# EAGLE design distribution-puissance (EAGLE 9.3.0)
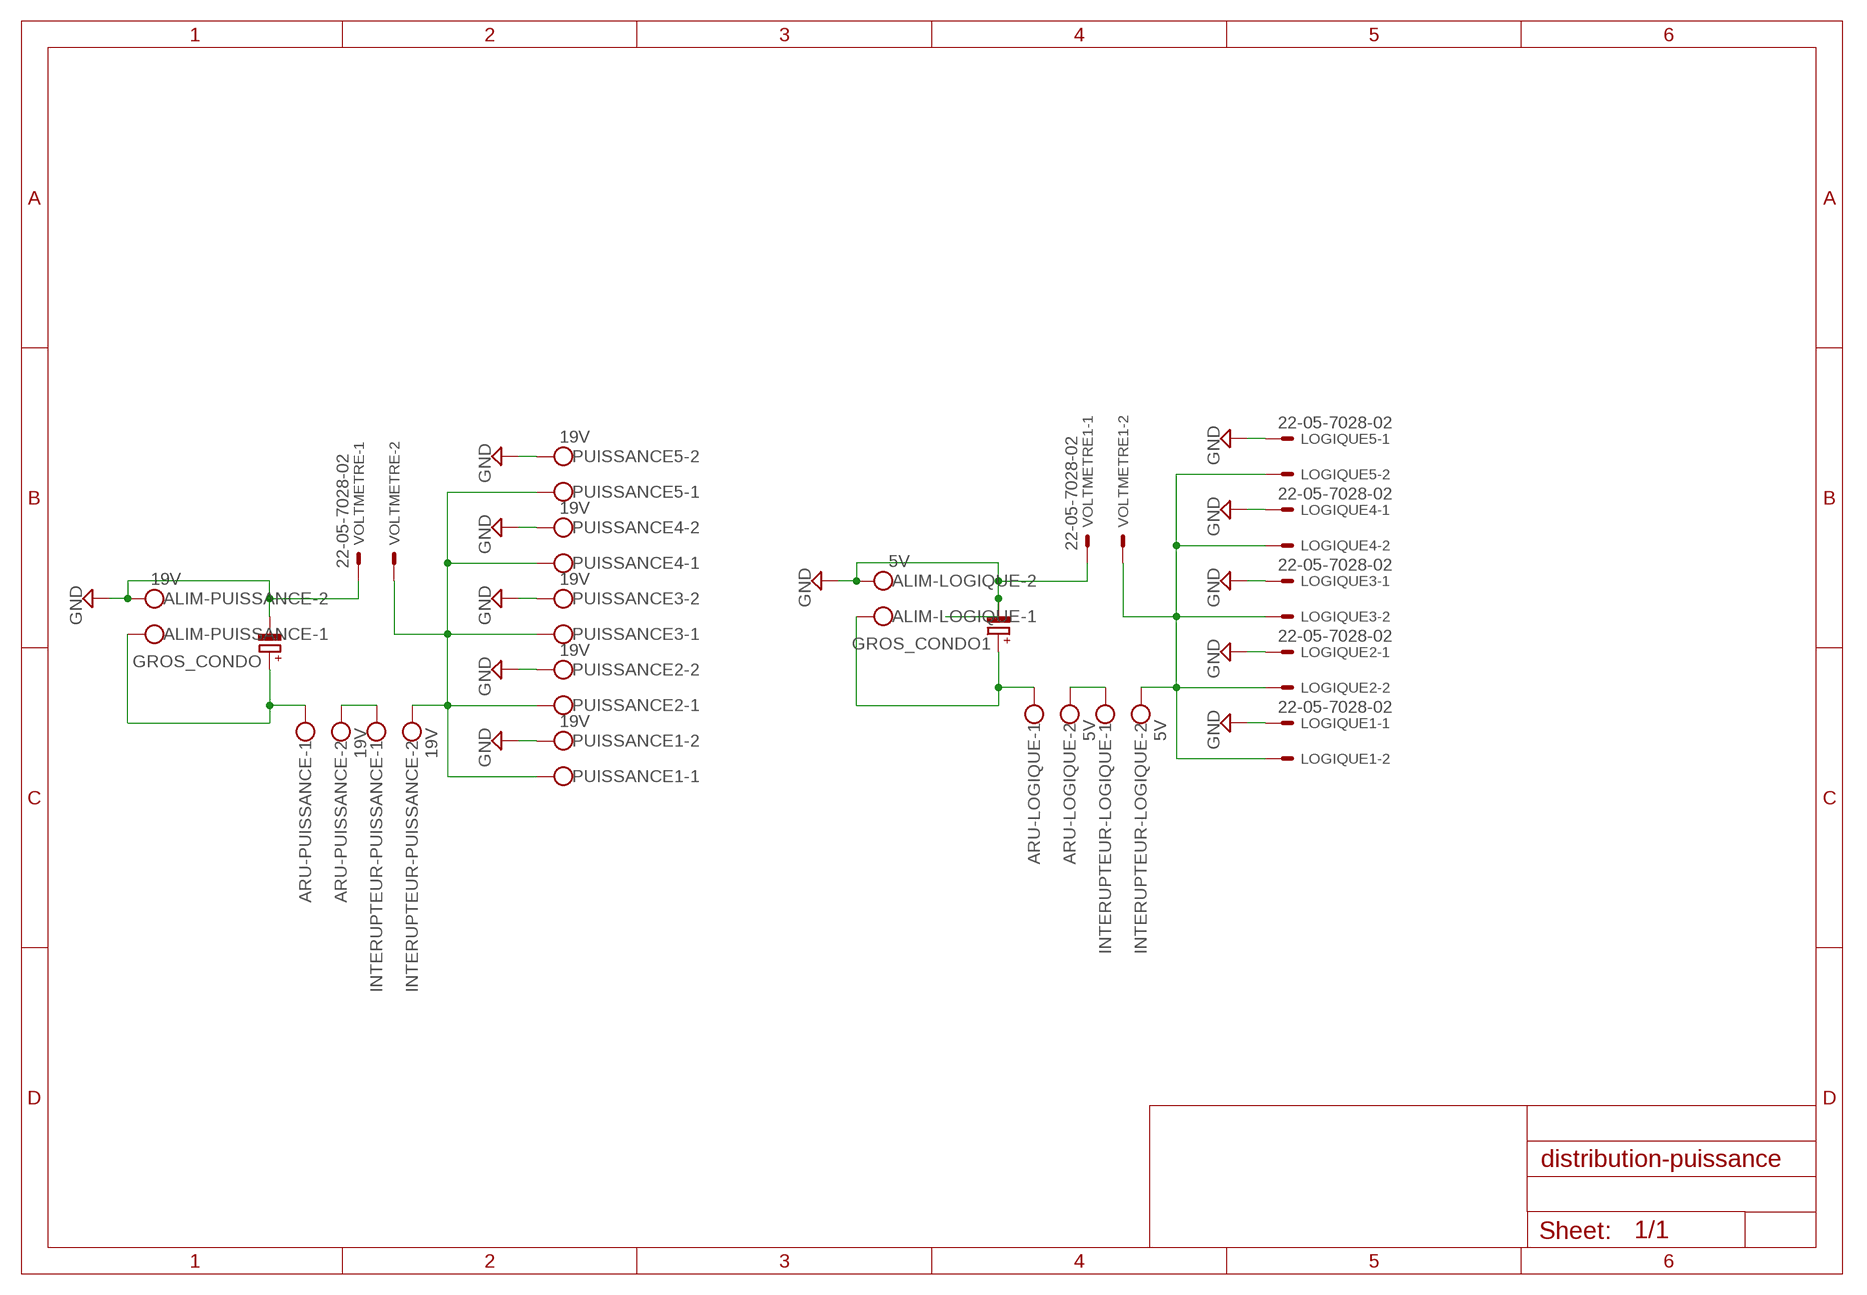
[diagram p0: schematic, sheet 1]

## Parts
ALIM-LOGIQUE  5V  W237-102  [W237-102]
ALIM-PUISSANCE  19V  W237-102  [W237-102]
ARU-LOGIQUE  5V  W237-102  [W237-102]
ARU-PUISSANCE  19V  W237-102  [W237-102]
GROS_CONDO  CPOL-EUE10-22.5  [EB22,5D]
GROS_CONDO1  CPOL-EUE10-22.5  [EB22,5D]
INTERUPTEUR-LOGIQUE  5V  W237-102  [W237-102]
INTERUPTEUR-PUISSANCE  19V  W237-102  [W237-102]
LOGIQUE1  22-05-7028-02  [7395-02]
LOGIQUE2  22-05-7028-02  [7395-02]
LOGIQUE3  22-05-7028-02  [7395-02]
LOGIQUE4  22-05-7028-02  [7395-02]
LOGIQUE5  22-05-7028-02  [7395-02]
PUISSANCE1  19V  W237-102  [W237-102]
PUISSANCE2  19V  W237-102  [W237-102]
PUISSANCE3  19V  W237-102  [W237-102]
PUISSANCE4  19V  W237-102  [W237-102]
PUISSANCE5  19V  W237-102  [W237-102]
VOLTMETRE  22-05-7028-02  [7395-02]
VOLTMETRE1  22-05-7028-02  [7395-02]

## Nets
GND: ALIM-LOGIQUE.2 ALIM-PUISSANCE.2 GROS_CONDO1.- GROS_CONDO.- LOGIQUE1.1 LOGIQUE2.1 LOGIQUE3.1 LOGIQUE4.1 LOGIQUE5.1 PUISSANCE1.2 PUISSANCE2.2 PUISSANCE3.2 PUISSANCE4.2 PUISSANCE5.2 VOLTMETRE1.1 VOLTMETRE.1
N$1: INTERUPTEUR-PUISSANCE.2 PUISSANCE1.1 PUISSANCE2.1 PUISSANCE3.1 PUISSANCE4.1 PUISSANCE5.1 VOLTMETRE.2
N$2: INTERUPTEUR-LOGIQUE.2 LOGIQUE1.2 LOGIQUE2.2 LOGIQUE3.2 LOGIQUE4.2 LOGIQUE5.2 VOLTMETRE1.2
N$3: ALIM-PUISSANCE.1 ARU-PUISSANCE.1 GROS_CONDO.+
N$4: ALIM-LOGIQUE.1 ARU-LOGIQUE.1 GROS_CONDO1.+
N$5: ARU-PUISSANCE.2 INTERUPTEUR-PUISSANCE.1
N$6: ARU-LOGIQUE.2 INTERUPTEUR-LOGIQUE.1

## Library data of the parts
ALIM-LOGIQUE ALIM-PUISSANCE ARU-LOGIQUE ARU-PUISSANCE INTERUPTEUR-LOGIQUE INTERUPTEUR-PUISSANCE PUISSANCE1-PUISSANCE5 = con-wago-500:W237-102: WAGO SCREW CLAMP; MPN: 237-102; OC_FARNELL: unknown; OC_NEWARK: 70K9898
GROS_CONDO GROS_CONDO1 = rcl:CPOL-EU: POLARIZED CAPACITOR, European symbol
LOGIQUE1-LOGIQUE5 VOLTMETRE VOLTMETRE1 = con-molex:22-?-02: CONNECTOR wire to board 2.54 mm (.1 inch) pitch header; OC_FARNELL: 9731601; OC_NEWARK: unknown

## Board
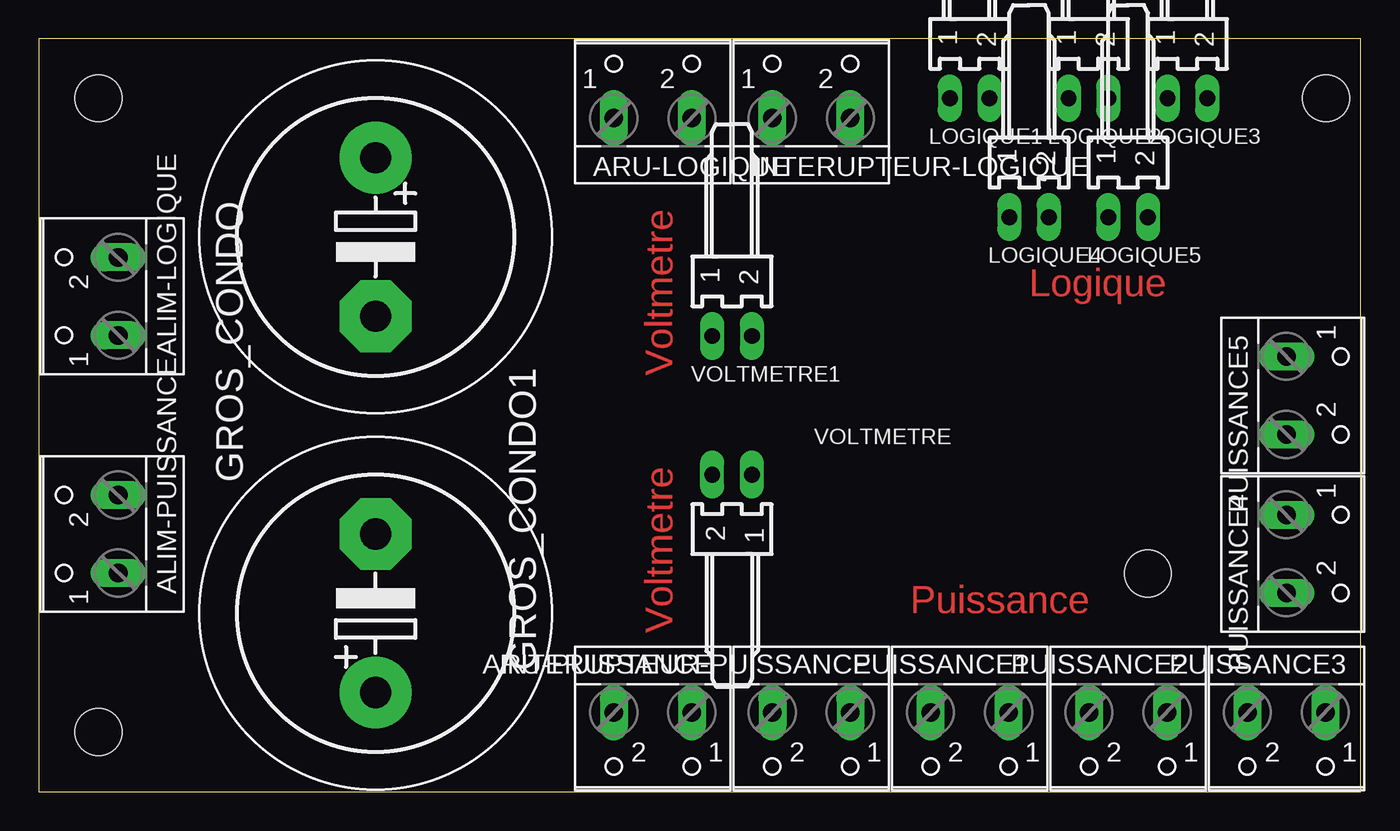
[diagram p1: board, top side]
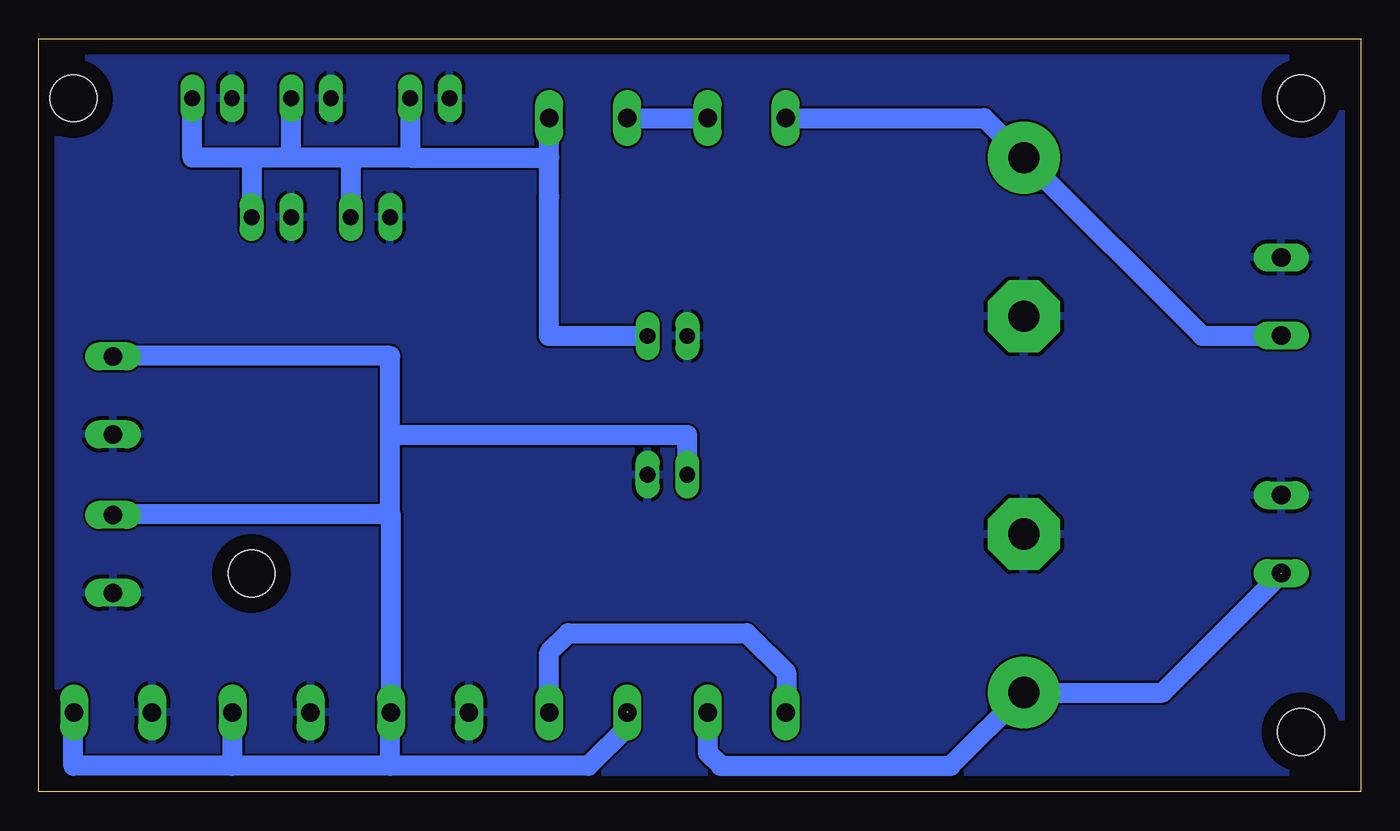
[diagram p2: board, bottom side, seen from below]

Size 84.76 x 48.25 mm. Coordinates in mm from the lower left corner, seen from the top.
Outline: 0,0 84.76,0 84.76,48.25 0,48.25 0,0
Copper layers (1*16): Top 0.035mm / dielectric 1.5mm / Bottom 0.035mm
Design rules "default": minimum track width 6mil, minimum drill 0.35mm, track to track 6mil, track to pad 6mil, pad to pad 6mil, via to via 6mil, smd to smd 6mil, copper to edge 40mil, drill to drill 6mil, minimum pad ring 10mil, minimum via ring 8mil, stop-mask expansion 4mil, vias tented up to drill 0mil, thermal gap 10mil
Holes 3 mm at 71.12,13.97 82.55,44.45 3.81,44.45 3.81,3.81

### Footprints (pad centres in the part's own frame; a part is rotated, then mirrored left to right if it is on the bottom)
W237-102 = drill 1.194 long: 1 -2.5,-1.27; 2 2.5,-1.27
EB22,5D = drill 2.007 pad 4.597: + -5.08,0 | drill 2.007 pad 4.597 octagon: - 5.08,0
7395-02 = drill 1.016 long: 1 1.27,0; 2 -1.27,0

### Placement (x,y rotation side)
ALIM-LOGIQUE  3.81,31.75 90 top
ALIM-PUISSANCE  3.81,16.51 90 top
ARU-LOGIQUE  39.37,44.45 0 top
ARU-PUISSANCE  39.37,3.81 180 top
GROS_CONDO  21.59,11.43 90 top
GROS_CONDO1  21.59,35.56 270 top
INTERUPTEUR-LOGIQUE  49.53,44.45 0 top
INTERUPTEUR-PUISSANCE  49.53,3.81 180 top
LOGIQUE1  59.69,44.45 180 top
LOGIQUE2  67.31,44.45 180 top
LOGIQUE3  73.66,44.45 180 top
LOGIQUE4  63.5,36.83 180 top
LOGIQUE5  69.85,36.83 180 top
PUISSANCE1  59.69,3.81 180 top
PUISSANCE2  69.85,3.81 180 top
PUISSANCE3  80.01,3.81 180 top
PUISSANCE4  81.28,15.24 270 top
PUISSANCE5  81.28,25.4 270 top
VOLTMETRE  44.45,20.32 0 top
VOLTMETRE1  44.45,29.21 180 top

### Tracks (layer width: path | path; a pad name or v marks a point on that pad's centre or on a via)
GND
  pour Bottom: 0,48.26 0,0 85.09,0 85.09,48.26
N$1  (1 unrouted)
  Bottom 1.27: PUISSANCE4.1 79.97,17.78 62.23,17.78 | PUISSANCE5.1 79.97,27.94 62.23,27.94 62.23,22.86 | 46.99,5.08 46.99,4.19 49.53,1.65 62.23,1.65 | 62.23,1.65 62.23,5.04 PUISSANCE1.1 62.19,17.74 62.23,17.78 | 62.23,1.65 72.39,1.65 | PUISSANCE2.1 72.35,1.69 72.39,1.65 | 72.39,1.65 82.55,1.65 82.55,5.04 PUISSANCE3.1 | 62.23,17.78 62.23,22.86 | VOLTMETRE.2 43.18,22.86 62.23,22.86
N$2
  Bottom 1.27: 52.03,40.64 52.03,38.14 52.07,38.1 52.07,29.21 VOLTMETRE1.2 | 52.03,40.64 INTERUPTEUR-LOGIQUE.2 | LOGIQUE1.2 60.96,40.64 | 60.96,40.64 52.03,40.64 | 60.96,40.64 64.77,40.64 | 64.77,40.64 LOGIQUE4.2 | 64.77,40.64 68.58,40.64 | 68.58,40.64 LOGIQUE2.2 | 68.58,40.64 71.12,40.64 | 71.12,40.64 LOGIQUE5.2 | 71.12,40.64 74.93,40.64 LOGIQUE3.2
N$3  (1 unrouted)
  Bottom 1.27: ARU-PUISSANCE.1 41.87,2.5 41.02,1.65 26.29,1.65 GROS_CONDO.+ 12.7,6.35 5.08,13.97
N$4
  Bottom 1.27: ARU-LOGIQUE.1 24.13,43.18 GROS_CONDO1.+ 10.16,29.21 5.12,29.21 ALIM-LOGIQUE.1
N$5
  Bottom 1.27: INTERUPTEUR-PUISSANCE.1 52.03,8.93 50.8,10.16 39.37,10.16 36.83,7.62 36.83,5.12 ARU-PUISSANCE.2
N$6
  Bottom 1.27: INTERUPTEUR-LOGIQUE.1 ARU-LOGIQUE.2

### Text on the board
Top: Logique | Voltmetre | Puissance | Voltmetre